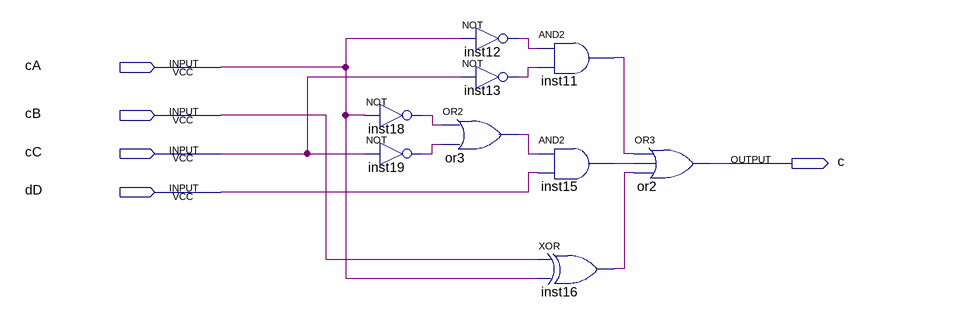
[diagram p0: schematic sheet]
// Quartus schematic segmentoC.bdf as structural Verilog: 9 symbols, 5 pins
module segmentoC (
  input  cA,
  input  cB,
  input  cC,
  input  dD,
  output c
);

  wire inst11_out, inst12_out, inst13_out, inst15_out, inst16_out, inst18_out, inst19_out, or3_out;

  not inst18 (inst18_out, cA);
  not inst19 (inst19_out, cC);
  not inst12 (inst12_out, cA);
  not inst13 (inst13_out, cC);
  or or3 (or3_out, inst18_out, inst19_out);
  and inst11 (inst11_out, inst12_out, inst13_out);
  and inst15 (inst15_out, or3_out, dD);
  xor inst16 (inst16_out, cB, cA);
  or or2 (c, inst11_out, inst15_out, inst16_out);
endmodule
